# EAGLE schematic layout (EAGLE 9.6.2)
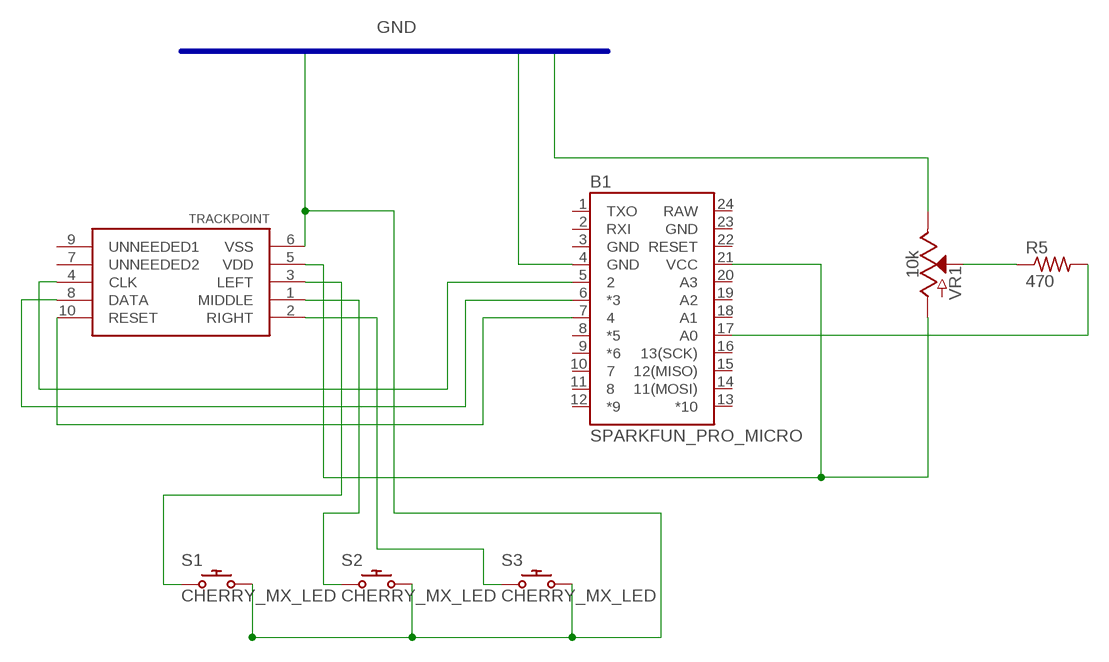
[diagram p0: schematic, sheet 1]

## Parts
B1  SPARKFUN_PRO_MICRO  [SPARKFUN_PRO_MICRO]
R5  470  R-US_0207/10  [0207/10]
S1  CHERRY_MX_LED  [CHERRY_MX_LED]
S2  CHERRY_MX_LED  [CHERRY_MX_LED]
S3  CHERRY_MX_LED  [CHERRY_MX_LED]
TRACKPOINT  BOARD  [BOARD]
VR1  10k  POTENTIOMETER-PTH-9MM-1/20W-20%-KIT  [POT-PTH-ALPS-KIT]

## Nets
GND: B1.4(GND) S1.S2 S2.S2 S3.S2 TRACKPOINT.6(VSS) VR1.P$1(E)
N$1: B1.6(*3) TRACKPOINT.8(DATA)
N$2: B1.7 TRACKPOINT.10(RESET)
N$3: B1.5 TRACKPOINT.4(CLK)
N$4: R5.1 VR1.P$2(S)
N$5: B1.17(A0) R5.2
N$6: S1.S1 TRACKPOINT.3(LEFT)
N$7: S2.S1 TRACKPOINT.1(MIDDLE)
N$8: S3.S1 TRACKPOINT.2(RIGHT)
N$10: B1.21(VCC) TRACKPOINT.5(VDD) VR1.P$3(A)
Unconnected: B1.1(TXO) B1.2(RXI) B1.8(*5) B1.9(*6) B1.10 B1.11 B1.12(*9) B1.13(*10) B1.14(11(MOSI)) B1.15(12(MISO)) B1.16(13(SCK)) B1.18(A1) B1.19(A2) B1.20(A3) B1.22(RESET) S1.L1(A) S1.L2(C) S2.L1(A) S2.L2(C) S3.L1(A) S3.L2(C) TRACKPOINT.7(UNNEEDED2) TRACKPOINT.9(UNNEEDED1)

## Buses
GND

## Power pins joined to a net without a drawn wire
GND: B1.3(GND) B1.23(GND)
RAW: B1.24(RAW)

## Library data of the parts
B1 = SparkFun-Boards:SPARKFUN_PRO_MICRO: SparkFun Pro Micro Atmega32U4 compatible footprint. SparkFun Products: 3.3V/8MHz <https://www.sparkfun.com/products/12587> 5V/16MHz <https://www.sparkfun.com/products/12640>
R5 = rcl:R-US_: RESISTOR, American symbol
S1-S3 = cherry:CHERRY_MX_LED: Cherry MX with LED; FARNELL: 2292961; MOUSER: 540_MX1A_11NW
TRACKPOINT = library:BOARD: TrackPoint board with cable broken off
VR1 = SparkFun-Resistors:POTENTIOMETER: Potentiometer (Pot) Three-terminal potentiometers, with an adjustable wiper and two adjustable resistors. A pot can be used to create a configurable voltage divider, or as a variable resistor. Variants ALPS_POT and ALPS_POT_KIT - PTH, breadboard compatible, 9mm square pots Rotary Potentiometer - Linear (10k ohm) <https://www.sparkfun.com/products/9288> (COM-09288) The KIT variant exposes copper on only one side of the PTH pad, so the part can only be assembled on one side of the PCB. Useful for beginner soldering kits.; PROD_ID: RES-09177; SF_SKU: COM-09288